# Altium schematic sheet PB_MOUNTS.SchDoc: Mounts, Logo & Label
size A4; SheetNumber: 1; SheetTotal: 100; Organization: Altium Limited.; Address1: Level 3, 12a Rodborough Rd; Address2: Frenchs Forest 2086; Address3: NSW; Address4: AUSTRALIA; PageSetup: Record=PageOptions|CenterHorizontal=True|CenterVertical=True|PrintScale=1.00|XCorrection=1.00|YCorrection=1.00|PrintKind=0|BorderSize=5000000|LeftOffset=0|BottomOffset=0|Orientation=2|PaperLength=1000|PaperWidth=1000|Scale=100|PaperSource=7|PrintQuality=-4|MediaType=1|DitherType=10|PaperKind=A4 (210 x 297 mm)|PrintScaleMode=1
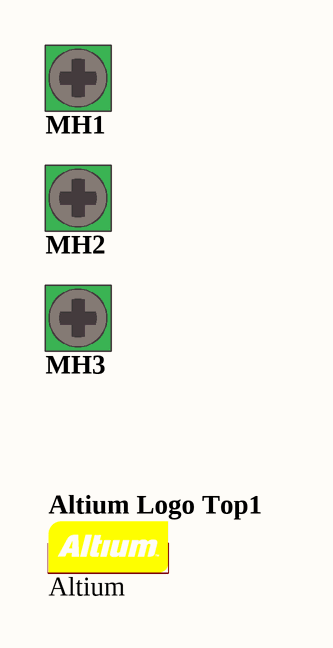
[diagram p0: PB_MOUNTS.SchDoc]

## Parts
Altium_Logo_Top1  Altium  [Logo-Altium]  (no BOM)
MH1  MOUNTING HOLE 3MM  [MOUNTING_HOLE_3MM]  (value not drawn)  (no BOM)
MH2  MOUNTING HOLE 3MM  [MOUNTING_HOLE_3MM]  (value not drawn)  (no BOM)
MH3  MOUNTING HOLE 3MM  [MOUNTING_HOLE_3MM_RND]  (value not drawn)  (no BOM)

## Nets

Not connected (* = marked no-connect by the designer): MH1 1; MH2 1; MH3 1

## Notes on the sheet
- Sheet Title
- Project Title
- Size:
- Date:
- A4
- Assy:
- Time:
- Revision:
- Sheet
- of
- File:

## Library data of the parts
Altium_Logo_Top1 = D-000-0003: Altium Logo for PCB; Category: Graphic-PCB; Status: Production
MH1 MH2 = D-001-0001: Mounting Hole, M3 Screw, Plated, Square Pad; Category: Mounting-Hole; Status: Production
MH3 = D-001-0000: Mounting Hole, M3 Screw, Plated, Round Pad; Category: Mounting-Hole; Status: Production